# EAGLE design ADS1298-breakout (EAGLE 6.5.0)
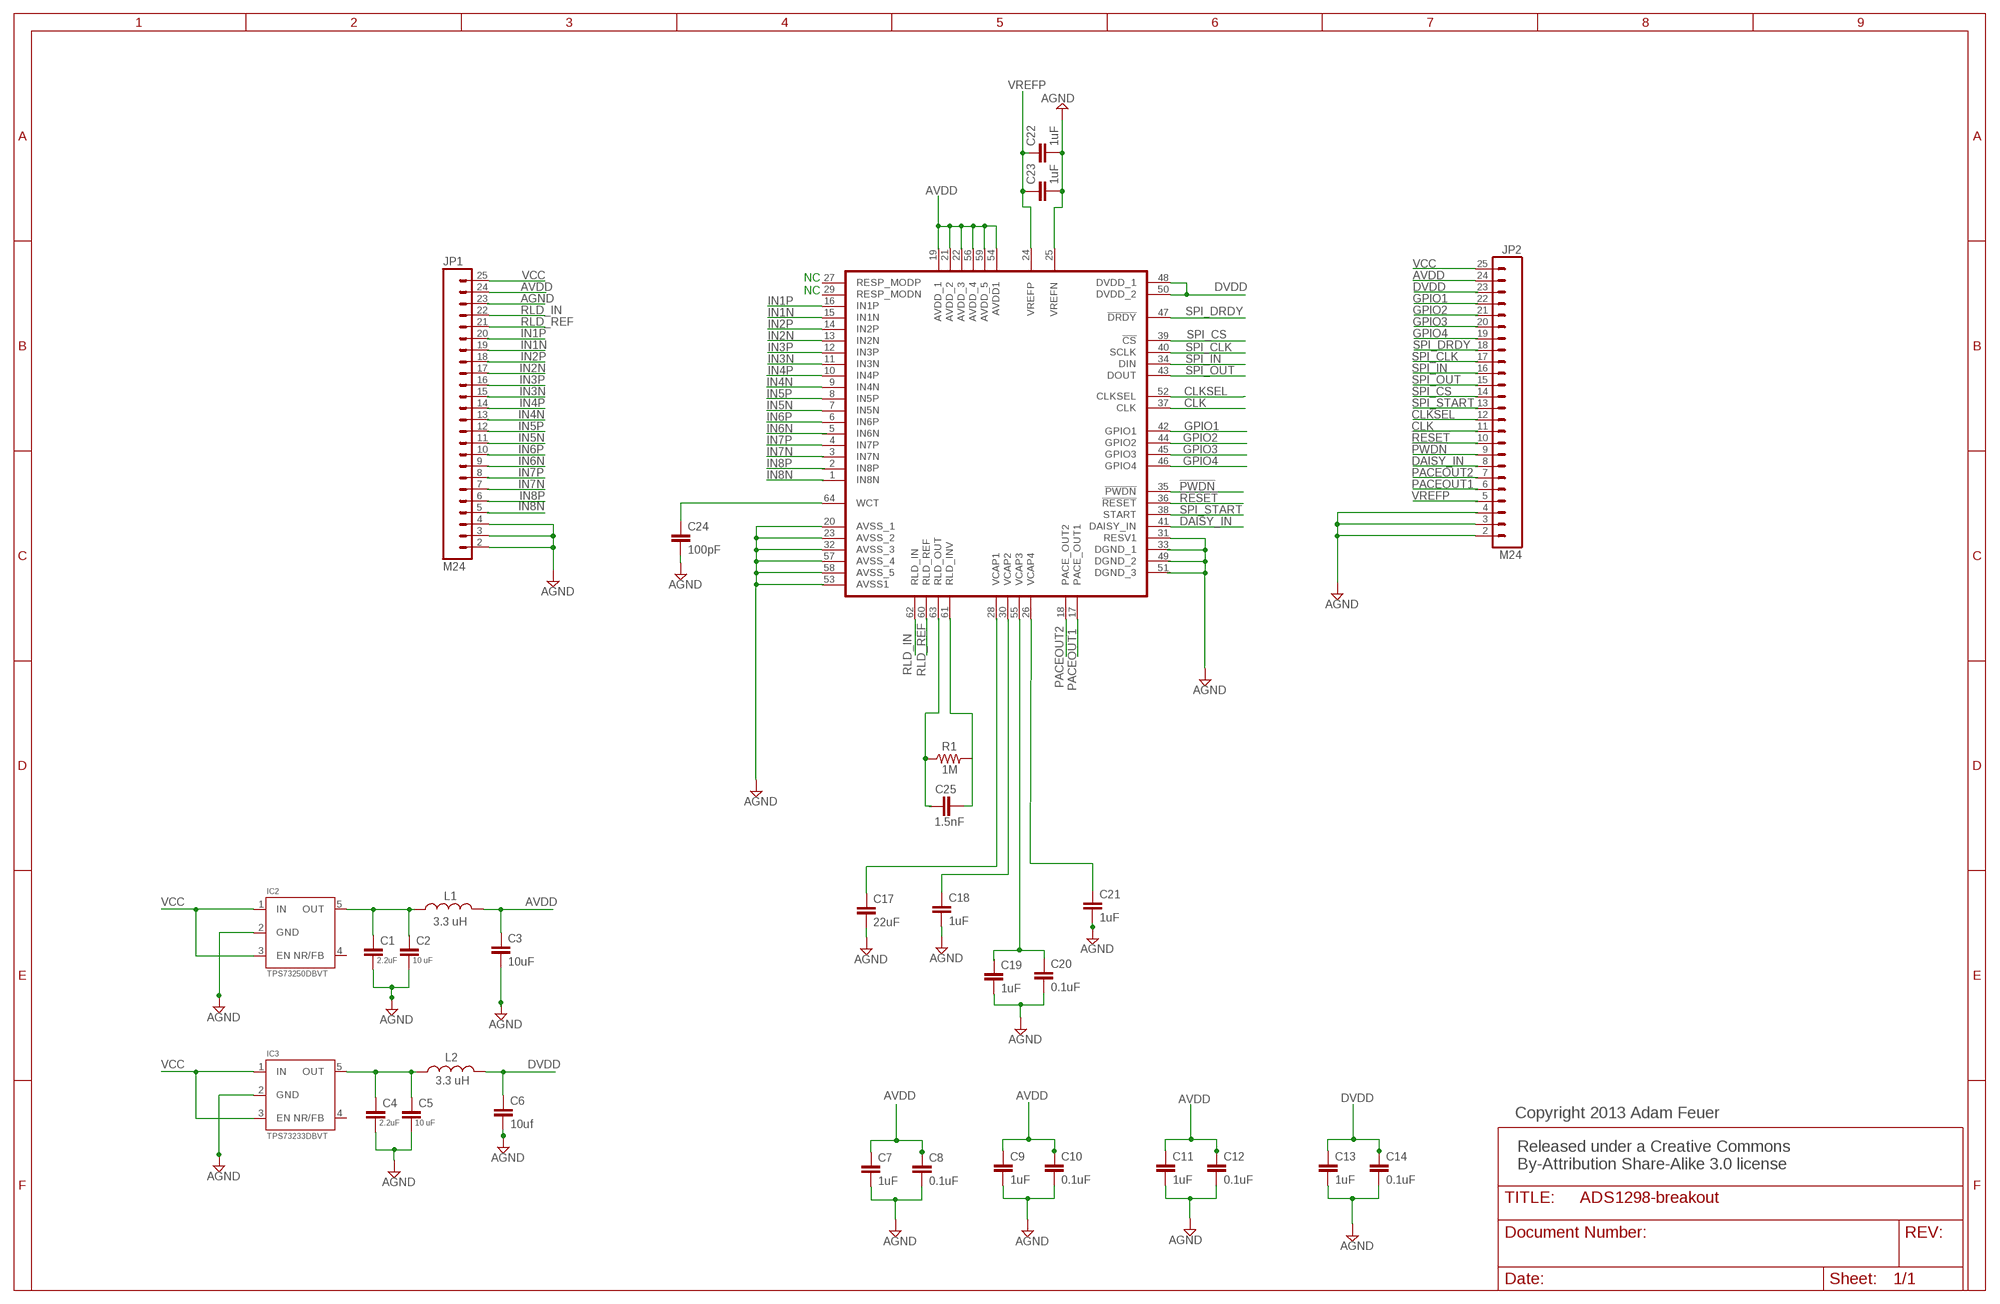
[diagram p0: schematic, sheet 1]

## Parts
C1  2.2uF  CAP0603-CAP  [0603-CAP]
C2  10 uF  CAP0603-CAP  [0603-CAP]
C3  10uF  CAP0603-CAP  [0603-CAP]
C4  2.2uF  CAP0603-CAP  [0603-CAP]
C5  10 uF  CAP0603-CAP  [0603-CAP]
C6  10uf  CAP0603-CAP  [0603-CAP]
C7  1uF  CAP0603-CAP  [0603-CAP]
C8  0.1uF  CAP0603-CAP  [0603-CAP]
C9  1uF  CAP0603-CAP  [0603-CAP]
C10  0.1uF  CAP0603-CAP  [0603-CAP]
C11  1uF  CAP0603-CAP  [0603-CAP]
C12  0.1uF  CAP0603-CAP  [0603-CAP]
C13  1uF  CAP0603-CAP  [0603-CAP]
C14  0.1uF  CAP0603-CAP  [0603-CAP]
C17  22uF  CAP0603-CAP  [0603-CAP]
C18  1uF  CAP0603-CAP  [0603-CAP]
C19  1uF  CAP0603-CAP  [0603-CAP]
C20  0.1uF  CAP0603-CAP  [0603-CAP]
C21  1uF  CAP0603-CAP  [0603-CAP]
C22  1uF  CAP0603-CAP  [0603-CAP]
C23  1uF  CAP0603-CAP  [0603-CAP]
C24  100pF  CAP0603-CAP  [0603-CAP]
C25  1.5nF  CAP0603-CAP  [0603-CAP]
IC1  ADS1298*PAG*  [TQFP64]
IC2  TPS73250DBVT  TPS732XXDBV  [SOT23-5]
IC3  TPS73233DBVT  TPS732XXDBV  [SOT23-5]
JP1  M24  [1X24]
JP2  M24  [1X24]
L1  3.3 uH  INDUCTOR0603  [0603]
L2  3.3 uH  INDUCTOR0603  [0603]
R1  1M  RESISTOR0603-RES  [0603-RES]

## Nets
!PWDN: IC1.35(!PWDN) JP2.9
!RESET: IC1.36(!RESET) JP2.10
AGND: C1.2 C2.2 C3.2 C4.2 C5.2 C6.2 C7.2 C8.2 C9.2 C10.2 C11.2 C12.2 C13.2 C14.2 C17.2 C18.2 C19.2 C20.2 C21.2 C22.2 C23.2 C24.2 IC1.20(AVSS_1) IC1.23(AVSS_2) IC1.25(VREFN) IC1.31(RESV1) IC1.32(AVSS_3) IC1.33(DGND_1) IC1.49(DGND_2) IC1.51(DGND_3) IC1.53(AVSS1) IC1.57(AVSS_4) IC1.58(AVSS_5) IC2.2(GND) IC3.2(GND) JP1.2 JP1.3 JP1.4 JP1.23 JP2.2 JP2.3 JP2.4
AVDD: C3.1 C7.1 C8.1 C9.1 C10.1 C11.1 C12.1 IC1.19(AVDD_1) IC1.21(AVDD_2) IC1.22(AVDD_3) IC1.54(AVDD1) IC1.56(AVDD_4) IC1.59(AVDD_5) JP1.24 JP2.24 L1.2
CLK: IC1.37(CLK) JP2.11
CLKSEL: IC1.52(CLKSEL) JP2.12
DAISY_IN: IC1.41(DAISY_IN) JP2.8
DVDD: C6.1 C13.1 C14.1 IC1.48(DVDD_1) IC1.50(DVDD_2) JP2.23 L2.2
GPIO1: IC1.42(GPIO1) JP2.22
GPIO2: IC1.44(GPIO2) JP2.21
GPIO3: IC1.45(GPIO3) JP2.20
GPIO4: IC1.46(GPIO4) JP2.19
IN1N: IC1.15(IN1N) JP1.19
IN1P: IC1.16(IN1P) JP1.20
IN2N: IC1.13(IN2N) JP1.17
IN2P: IC1.14(IN2P) JP1.18
IN3N: IC1.11(IN3N) JP1.15
IN3P: IC1.12(IN3P) JP1.16
IN4N: IC1.9(IN4N) JP1.13
IN4P: IC1.10(IN4P) JP1.14
IN5N: IC1.7(IN5N) JP1.11
IN5P: IC1.8(IN5P) JP1.12
IN6N: IC1.5(IN6N) JP1.9
IN6P: IC1.6(IN6P) JP1.10
IN7N: IC1.3(IN7N) JP1.7
IN7P: IC1.4(IN7P) JP1.8
IN8N: IC1.1(IN8N) JP1.5
IN8P: IC1.2(IN8P) JP1.6
N$1: C4.1 C5.1 IC3.5(OUT) L2.1
N$2: C1.1 C2.1 IC2.5(OUT) L1.1
N$3: C17.1 IC1.28(VCAP1)
N$4: C18.1 IC1.30(VCAP2)
N$5: C19.1 C20.1 IC1.55(VCAP3)
N$7: C24.1 IC1.64(WCT)
N$8: C21.1 IC1.26(VCAP4)
PACEOUT1: IC1.17(PACE_OUT1) JP2.6
PACEOUT2: IC1.18(PACE_OUT2) JP2.7
RLD_IN: IC1.62(RLD_IN) JP1.22
RLD_INV: C25.2 IC1.61(RLD_INV) R1.2
RLD_OUT: C25.1 IC1.63(RLD_OUT) R1.1
RLD_REF: IC1.60(RLD_REF) JP1.21
SPI_CLK: IC1.40(SCLK) JP2.17
SPI_CS: IC1.39(!CS) JP2.14
SPI_DRDY: IC1.47(!DRDY) JP2.18
SPI_IN: IC1.34(DIN) JP2.16
SPI_OUT: IC1.43(DOUT) JP2.15
SPI_START: IC1.38(START) JP2.13
VCC: IC2.1(IN) IC2.3(EN) IC3.1(IN) IC3.3(EN) JP1.25 JP2.25
VREFP: C22.1 C23.1 IC1.24(VREFP) JP2.5
Unconnected: IC1.27(RESP_MODP) IC1.29(RESP_MODN) IC2.4(NR/FB) IC3.4(NR/FB)

## Notes on the sheet
- NC
- NC
- Copyright 2013 Adam Feuer
- Released under a Creative Commons 
  By-Attribution Share-Alike 3.0 license

## Library data of the parts
C1-C14 C17-C25 = SparkFun-Passives:CAP: Capacitor Standard 0603 ceramic capacitor, and 0.1" leaded capacitor.
IC1 = burr-brown-5a:ADS1298: 8-Channel, 24-Bit Analog-To-Digital Converter With Integrated ECG Front End. Warning: PAG variant (TQFP package) does not have Respiration Module - pins 27 and 29 must stay unconnected! Drawn 23.07.2011 by Tomasz Boleslaw CEDRO (http://www.tomek.cedro.info).
IC2 IC3 = TPS32xx:TPS732XX: Cap-Free, NMOS, 250mA Low Dropout Regulator with Reverse Current Protection
JP1 JP2 = SparkFun-Connectors:M24: 1x24 .1" header
L1 L2 = SparkFun-Passives:INDUCTOR: Inductors Basic Inductor/Choke - 0603 and 1206. Footprints are not proven and vary greatly between part numbers. SRN6045- 33uH, 20% 1.4A
R1 = SparkFun-Passives:RESISTOR: Resistor Basic schematic elements and footprints for 0603, 1206, and PTH resistors.

## Board
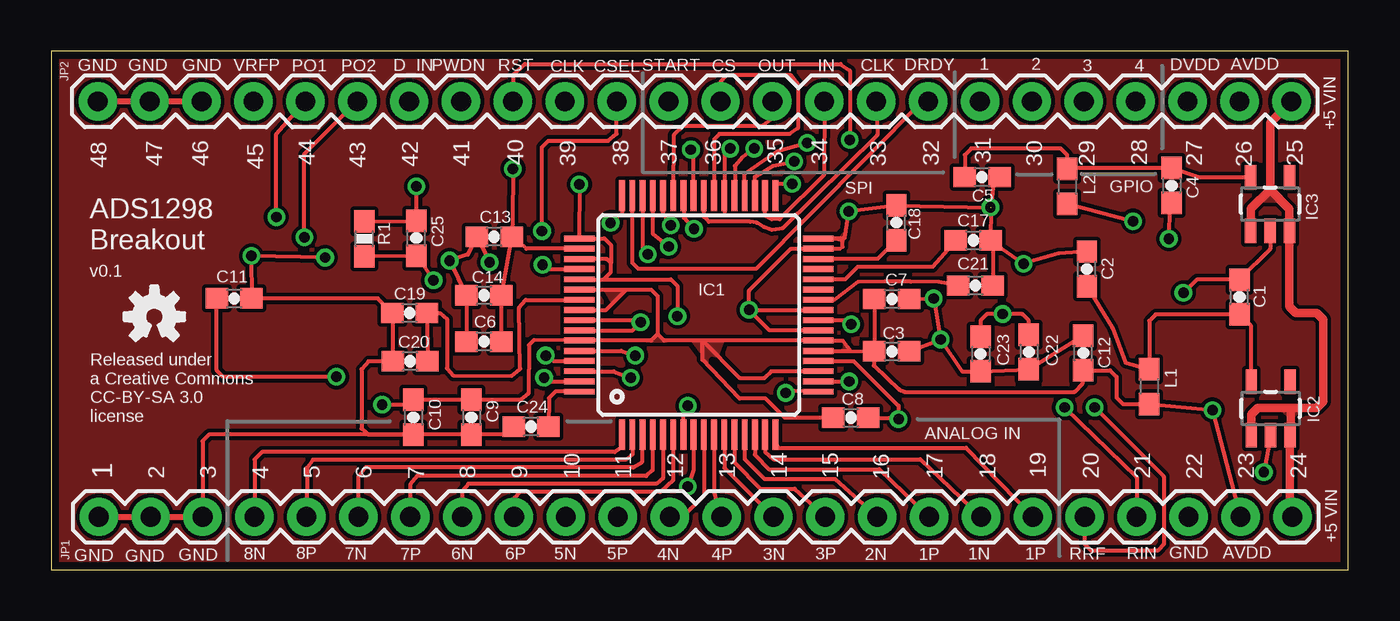
[diagram p1: board, top side]
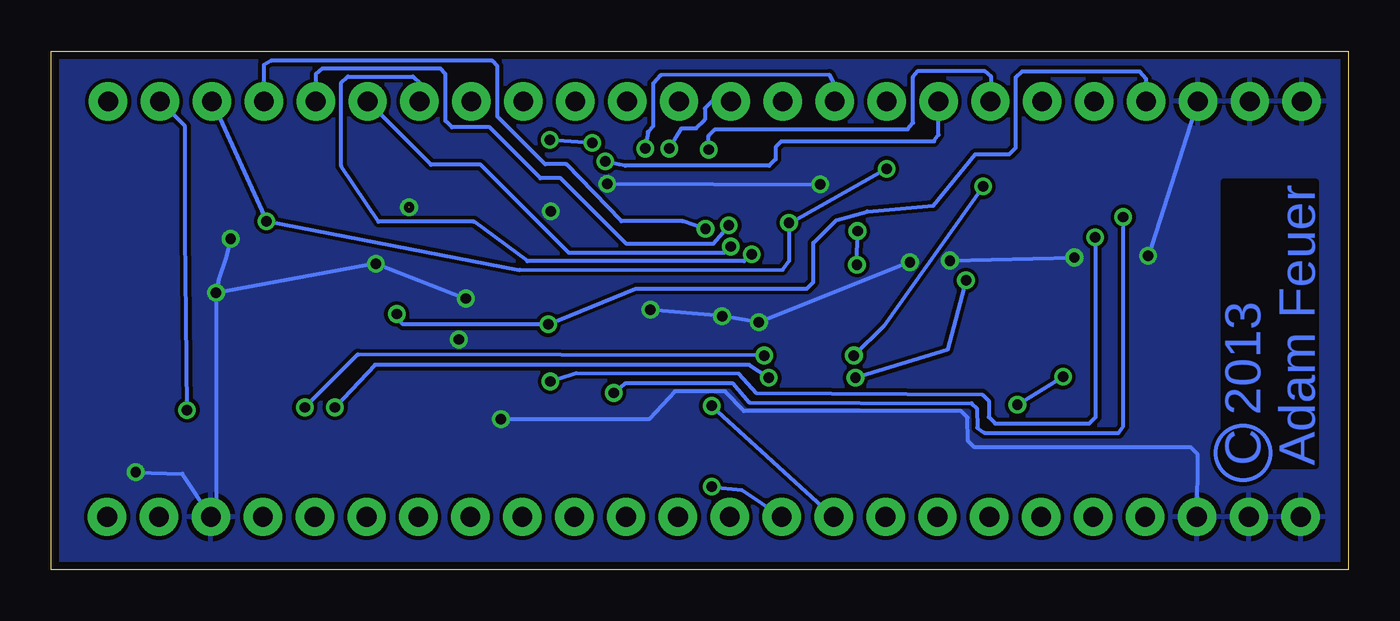
[diagram p2: board, bottom side, seen from below]

Size 63.5 x 25.4 mm. Coordinates in mm from the lower left corner, seen from the top.
Outline: 0,0 63.5,0 63.5,25.4 0,25.4 0,0
Copper layers (1*16): Top 0.0356mm / dielectric 1.5011mm / Bottom 0.0356mm
Design rules "APCircuits": minimum track width 8mil, minimum drill 13mil, track to track 7mil, track to pad 7mil, pad to pad 7mil, via to via 7mil, smd to smd 7mil, copper to edge 15mil, drill to drill 7mil, minimum pad ring 7mil, minimum via ring 7mil, stop-mask expansion 4mil, vias tented up to drill 0mil, thermal gap 10mil

### Footprints (pad centres in the part's own frame; a part is rotated, then mirrored left to right if it is on the bottom)
0603-CAP = smd 1.1 x 1: 1 -0.85,0; 2 0.85,0
TQFP64 = smd 1.5 x 0.285: 1 -5.85,3.75; 2 -5.85,3.25; 3 -5.85,2.75; 4 -5.85,2.25; 5 -5.85,1.75; 6 -5.85,1.25; 7 -5.85,0.75; 8 -5.85,0.25; 9 -5.85,-0.25; 10 -5.85,-0.75; 11 -5.85,-1.25; 12 -5.85,-1.75; 13 -5.85,-2.25; 14 -5.85,-2.75; 15 -5.85,-3.25; 16 -5.85,-3.75; 33 5.85,-3.75; 34 5.85,-3.25; 35 5.85,-2.75; 36 5.85,-2.25; 37 5.85,-1.75; 38 5.85,-1.25; 39 5.85,-0.75; 40 5.85,-0.25; 41 5.85,0.25; 42 5.85,0.75; 43 5.85,1.25; 44 5.85,1.75; 45 5.85,2.25; 46 5.85,2.75; 47 5.85,3.25; 48 5.85,3.75 | smd 0.285 x 1.5: 17 -3.75,-5.85; 18 -3.25,-5.85; 19 -2.75,-5.85; 20 -2.25,-5.85; 21 -1.75,-5.85; 22 -1.25,-5.85; 23 -0.75,-5.85; 24 -0.25,-5.85; 25 0.25,-5.85; 26 0.75,-5.85; 27 1.25,-5.85; 28 1.75,-5.85; 29 2.25,-5.85; 30 2.75,-5.85; 31 3.25,-5.85; 32 3.75,-5.85; 49 3.75,5.85; 50 3.25,5.85; 51 2.75,5.85; 52 2.25,5.85; 53 1.75,5.85; 54 1.25,5.85; 55 0.75,5.85; 56 0.25,5.85; 57 -0.25,5.85; 58 -0.75,5.85; 59 -1.25,5.85; 60 -1.75,5.85; 61 -2.25,5.85; 62 -2.75,5.85; 63 -3.25,5.85; 64 -3.75,5.85
SOT23-5 = smd 0.55 x 1.2: 1 -0.95,-1.3; 2 0,-1.3; 3 0.95,-1.3; 4 0.95,1.3; 5 -0.95,1.3
1X24 = drill 0.965 pad 1.88: 2 -26.67,0; 3 -24.13,0; 4 -21.59,0; 5 -19.05,0; 6 -16.51,0; 7 -13.97,0; 8 -11.43,0; 9 -8.89,0; 10 -6.35,0; 11 -3.81,0; 12 -1.27,0; 13 1.27,0; 14 3.81,0; 15 6.35,0; 16 8.89,0; 17 11.43,0; 18 13.97,0; 19 16.51,0; 20 19.05,0; 21 21.59,0; 22 24.13,0; 23 26.67,0; 24 29.21,0; 25 31.75,0
0603 = smd 1.1 x 1: 1 -0.85,0; 2 0.85,0
0603-RES = smd 1.1 x 1: 1 -0.85,0; 2 0.85,0

### Placement (x,y rotation side)
C1  58.17,13.36 90 top
C2  50.7,14.73 90 top
C3  41.15,10.69 0 top
C4  54.84,18.82 270 top
C5  45.57,19.23 0 top
C6  21.18,11.18 180 top
C7  41.15,13.26 0 top
C8  39.14,7.44 0 top
C9  20.57,7.47 270 top
C10  17.73,7.47 270 top
C11  8.97,13.28 0 top
C12  50.52,10.62 90 top
C13  21.69,16.31 180 top
C14  21.18,13.44 180 top
C17  45.14,16.13 0 top
C18  41.38,16.99 90 top
C19  17.55,12.57 180 top
C20  17.58,10.21 180 top
C21  45.24,13.92 0 top
C22  47.85,10.67 270 top
C23  45.49,10.57 270 top
C24  23.5,7.01 180 top
C25  17.88,16.23 90 top
IC1  31.7,12.47 90 top
IC2  59.69,7.9 0 top
IC3  59.66,17.91 0 top
JP1  29.01,2.59 0 top
JP2  28.96,22.94 0 top
L1  53.75,8.97 270 top
L2  49.73,18.77 270 top
R1  15.34,16.21 90 top
U$1  [OSHW-LOGO-S]  5.05,12.4 0 top

### Tracks (layer width: path | path; a pad name or v marks a point on that pad's centre or on a via)
!PWDN  (via drill 0.51)
  Top 0.203: IC1.35 34.45,19.23 35.36,19.79 v36.37,19.99
  Bottom 0.203: JP2.9 20.07,21.3 20.28,20.98 27.75,20.98 28.04,20.69 28.04,20.1 28.36,19.79 35.4,19.79 35.69,19.85 v36.37,19.99
!RESET  (via drill 0.51)
  Top 0.203: JP2.10 22.63,24.24 23.18,24.76 38.65,24.76 39.09,24.45 v39.09,21.06 | IC1.36 33.95,19.39 35.53,20.5 v37.01,20.9
  Bottom 0.203: v39.09,21.06 v37.01,20.9
AGND  (via drill 0.51)  (1 unrouted)
  Top 0.203: IC3.2 59.66,15.71 C1.2 56.07,14.21 v55.42,13.56 | IC2.2 v59.36,4.78 | C4.2 54.85,17.93 54.74,17.82 v54.71,16.2 | C5.2 46.11,18.92 46.01,17.73 | 46.01,17.73 C17.2 | C2.2 49.31,15.49 v47.6,14.99 C17.2 | C3.2 v43.54,11.28 | 46.01,17.73 C18.2 v39.04,17.55 38.84,16.26 | C7.2 v43.2,13.28 v43.54,11.28 | IC1.32 38.05,16.23 | 38.05,16.23 38.84,16.26 | IC1.33 35.46,18.9 v36.27,18.9 | C24.2 22.43,6.62 C9.2 C10.2 | C10.2 15.53,6.62 15.19,6.91 15.19,9.82 15.53,10.21 C20.2 16.73,12.55 C19.2 15.99,13.28 C11.2 v9.8,15.37 v13.41,15.29 | v34.16,12.72 IC1.25 | v34.16,12.72 34.16,13.67 36.22,15.72 IC1.31 38.61,15.72 38.73,15.82 38.73,16.13 | IC1.23 35.17,11.72 v34.16,12.72 | IC1.58 28.46,11.72 v28.85,12.12 28.75,12.22 IC1.57 | 27.41,15.01 27.41,14.58 27.05,14.22 IC1.53 30.34,14.22 30.66,13.9 v30.66,12.42 | 27.41,15.01 27.2,15.21 IC1.51 | 27.41,15.01 27.41,15.9 27.09,16.22 IC1.49 v25.86,18.87 | C6.2 C14.2 v19.51,15.14 20.4,15.43 C13.2 v21.46,15.06 | C12.2 C22.2 C23.2 44.59,9.72 v43.54,11.28 | C17.2 46.09,16.13 C21.2 | C8.2 41.4,7.44 v41.48,7.37 41.48,8.03 39.28,10.22 IC1.20 | C10.2 7.73,6.62 7.42,6.3 JP1.4 | 38.84,16.26 38.73,16.13 | 38.73,16.13 38.35,16.21 38.05,16.23
  Top 0.305: JP2.2 JP2.3 JP2.4 | JP1.2 JP1.3 JP1.4
  Bottom 0.203: v59.36,4.78 57.07,4.7 JP1.23 55.42,1.88 v55.42,13.56 | v55.42,13.56 v47.6,14.99 v43.2,13.28 | v54.71,16.2 54.95,15.24 55.3,14.24 v55.42,13.56 | JP2.4 v9.8,15.37 | v34.16,12.72 v30.66,12.42 v28.85,12.12 v21.46,15.06 | v19.51,15.14 v13.41,15.29 | JP1.4 7.4,5.68 7.72,5.99 18.3,5.99 18.62,6.31 18.64,7.46 18.96,7.77 29.59,7.77 30.5,8.74 32.97,8.74 34.24,7.37 v41.48,7.37 | v36.27,18.9 v25.86,18.87
  other vias: 45.97,17.75
  pour Bottom (rank 6): 0,25.4 0,-0.03 63.5,0 63.5,25.4
  pour Top: 38.79,16.54 38.53,16.26 38.84,16.03
AVDD  (via drill 0.51)
  Top 0.203: IC1.54 28.17,13.72 | 28.17,13.72 29.38,13.72 29.69,13.4 29.69,11.54 | 29.69,11.54 29.38,11.22 IC1.59 23.64,11.25 23.39,11.01 23.37,8.63 22.97,8.32 C9.1 C10.1 17.66,8.08 v16.2,8.08 | 31.88,11.22 IC1.22 38.73,11.23 38.96,10.93 39.14,10.71 | 31.88,11.22 30.01,11.22 29.69,11.54 | IC1.21 38.42,10.71 39.14,10.71 | 39.14,10.71 C3.1 | C3.1 40.27,10 41.51,8.84 41.76,8.71 50.1,8.71 50.49,9.13 C12.1 51.83,9.77 52.15,9.45 52.15,8.43 52.46,8.12 L1.2 v56.84,7.82 JP1.24 | v13.97,9.45 8.43,9.45 8.12,9.77 C11.1 | IC1.19 35.25,9.72 34.9,9.37 33.73,9.37 31.88,11.22 | C8.1 35.92,7.44 34.98,8.38 33.71,8.38 31.88,10.29 31.88,11.22 | C7.1 C3.1 | IC1.56 27.17,12.72 28.17,13.72
  Bottom 0.203: v56.84,7.82 56.9,12.37 56.95,16.38 56.95,21.72 JP2.24 | v16.2,8.08 v13.97,9.45
  pour Top: 27.43,13 28.19,13.74 27.03,13.74
  pour Top: 29.13,11.13 30.15,11.13 29.69,11.51
  pour Top: 31.29,11.23 32.18,10.06 32.18,10.31 32.31,10.44 32.64,10.36 32.97,11.23
  pour Top: 38.94,10.69 38.99,11.05 38.76,11.1 38.76,10.87 38.63,10.79
CLK  (via drill 0.51)
  Top 0.203: v34.42,20.62 33.82,20.19 33.48,19.77 IC1.37
  Bottom 0.203: JP2.11 25.15,23.79 25.41,24.23 33.67,24.21 34.04,23.81 34.04,21.74 34.29,21.44 v34.42,20.62
CLKSEL  (via drill 0.51)
  Top 0.203: v24.03,16.59 24.03,20.69 24.35,21.01 27.27,21.01 27.69,21.35 JP2.12 | v24.05,14.94 24.27,14.72 IC1.52
  Bottom 0.203: v24.05,14.94 v24.03,16.59
DAISY_IN  (via drill 0.51)
  Top 0.203: IC1.41 31.45,20.44 v31.32,20.57
  Bottom 0.203: v31.32,20.57 31.32,21.25 31,21.56 21.58,21.56 21.31,21.88 21.31,24.14 21.07,24.43 17.82,24.43 17.5,24.17 JP2.8
DVDD  (via drill 0.51)
  Top 0.203: IC1.50 23.27,15.72 C13.1 | C13.1 C14.1 C6.1 | L2.2 v52.96,17.07 | IC1.48 27.95,17.43 v27.38,16.99 | v22.61,19.63 22.59,17.06 C13.1
  Bottom 0.203: JP2.23 v52.96,17.07 40.56,14.68 27.69,14.7 27.38,15.14 v27.38,16.99 27.33,16.97 v22.61,19.63
GPIO1  (via drill 0.51)
  Top 0.203: IC1.42 30.98,17.23 v31.47,16.69
  Bottom 0.203: v31.47,16.69 32.59,17.07 35.59,17.07 38.28,19.86 39.32,19.86 41.66,22.2 41.66,24.65 41.9,24.92 52.74,24.92 53.09,24.73 JP2.22
GPIO2  (via drill 0.51)
  Top 0.203: IC1.44 29.95,17.5 v30.33,16.87
  Bottom 0.203: v30.33,16.87 30.63,16.48 31.09,15.95 35.33,15.95 38.56,19.18 39.55,19.18 42.04,21.67 43.88,21.67 44.2,21.98 44.2,24.27 44.44,24.54 50.23,24.54 50.55,24.27 JP2.21
GPIO3  (via drill 0.51)
  Top 0.203: IC1.45 29.45,16.47 v30.23,15.82
  Bottom 0.203: v30.23,15.82 30.56,15.52 38.15,15.52 42.47,19.84 44.91,19.84 JP2.20
GPIO4  (via drill 0.51)
  Top 0.203: IC1.46 28.95,15.68 v29.21,15.44
  Bottom 0.203: v29.21,15.44 29.57,15.11 40.18,15.11 42.8,17.04 47.47,17.04 49.3,19.76 49.3,23.86 48.98,24.15 45.78,24.15 45.47,23.86 JP2.19
IN1N
  Top 0.203: IC1.15 34.95,5.77 35.36,5.41 42.55,5.41 JP1.19
IN1P
  Top 0.203: IC1.16 35.42,6.31 35.59,5.97 44.78,5.97 JP1.20
IN2N
  Top 0.203: IC1.13 33.95,5.42 34.92,4.45 38.38,4.45 JP1.17
IN2P
  Top 0.203: IC1.14 34.45,5.63 35.13,4.93 40.54,4.93 JP1.18
IN3N
  Top 0.203: IC1.11 32.95,5 JP1.15
IN3P
  Top 0.203: IC1.12 33.45,5.26 34.72,3.96 36.4,3.96 JP1.16
IN4N
  Top 0.203: IC1.9 31.95,3.63 30.91,2.59 JP1.13
IN4P
  Top 0.203: IC1.10 32.45,3.77 JP1.14
IN5N  (via drill 0.51)
  Top 0.203: IC1.7 30.95,7.68 v31.17,8.03
  Bottom 0.203: v31.17,8.03 JP1.11
IN5P  (via drill 0.51)
  Top 0.203: IC1.8 31.45,4.88 v31.17,4.06
  Bottom 0.203: v31.17,4.06 29.69,3.91 JP1.12
IN6N
  Top 0.203: IC1.5 29.95,4.48 29.63,4.22 20.43,4.22 20.12,3.85 JP1.9
IN6P
  Top 0.203: IC1.6 30.45,4.38 29.83,3.81 22.95,3.81 22.66,3.49 JP1.10
IN7N
  Top 0.203: IC1.3 28.92,5.27 28.5,5 15.38,5 15.04,4.56 JP1.7
IN7P
  Top 0.203: IC1.4 29.45,4.89 29.13,4.6 17.92,4.6 17.58,4.18 JP1.8
IN8N
  Top 0.203: IC1.1 27.92,5.98 27.58,5.77 10.32,5.77 9.96,5.4 JP1.5
IN8P
  Top 0.203: IC1.2 28.45,5.63 28.13,5.38 12.81,5.38 12.52,4.99 JP1.6
N$1
  Top 0.203: IC3.5 56.19,19.21 C4.1 49.78,19.67 L2.1 49.73,20.31 49.42,20.62 45.03,20.62 44.72,20.31 C5.1
N$2
  Top 0.203: IC2.5 58.74,11.94 C1.1 54.06,12.51 53.75,12.19 L1.1 52.59,10.15 51.94,11.86 C2.1
N$3
  Top 0.203: C17.1 43.14,14.83 39.47,14.83 38.86,14.22 IC1.28
N$4
  Top 0.203: C18.1 40.45,15.22 IC1.30
N$5
  Top 0.203: C20.1 C19.1 19.04,12.57 19.38,12.28 19.38,9.87 19.67,9.53 22.54,9.5 22.96,9.84 22.91,12.85 23.23,13.22 IC1.55
N$6
  pour Top (rank 6): 0,25.4 0,0 63.5,0 63.5,25.4
N$7
  Top 0.203: IC1.64 24.69,8.72 24.37,8.4 C24.1
N$8
  Top 0.203: C21.1 43.45,14.1 42.06,14.11 40.83,14.12 39.5,14.1 38.34,13.22 IC1.26
PACEOUT1  (via drill 0.51)
  Top 0.203: IC1.17 36.38,8.75 v35.97,8.66 | v11.02,17.27 11.02,21.34 JP2.6
  Bottom 0.203: v35.97,8.66 35.84,8.74 35.38,9.14 30.15,9.14 29.34,8.2 18.45,8.15 18.19,7.91 18.16,6.95 17.82,6.71 11.24,6.71 11.02,7.02 v11.02,17.27
PACEOUT2  (via drill 0.51)
  Top 0.203: IC1.18 38.81,9.22 v39.06,9.22 | v12.39,16.28 12.39,20.34 JP2.7
  Bottom 0.203: v39.06,9.22 38.71,9.35 37.8,9.63 29.84,9.6 29.01,8.66 17.92,8.59 17.6,8.27 17.6,7.48 17.29,7.16 12.69,7.16 12.37,7.48 12.37,16.26 v12.39,16.28
RLD_IN  (via drill 0.51)
  Top 0.203: IC1.62 27.54,9.72 v28.37,9.4 | v49.61,7.95 53.14,4.52 JP1.22
  Bottom 0.203: v28.37,9.4 29.34,10.03 47.65,10.03 v49.61,7.95
RLD_INV  (via drill 0.51)
  Top 0.203: R1.2 C25.2 v17.88,18.77 | v24.21,10.49 24.6,10.22 IC1.61
  Bottom 0.203: v17.88,18.77 22.76,11.91 v24.21,10.49
RLD_OUT  (via drill 0.51)
  Top 0.203: R1.1 C25.1 v18.72,14.17 | v24.13,9.4 24.31,9.22 IC1.63
  Bottom 0.203: v18.72,14.17 19.63,10.77 v24.13,9.4
RLD_REF  (via drill 0.51)
  Top 0.203: IC1.60 27.91,10.72 v28.6,10.49 | v51.08,7.95 54.46,4.57 54.46,1.26 54.17,0.94 50.91,0.94 50.6,1.26 JP1.21
  Bottom 0.203: v28.6,10.49 48.46,10.54 48.49,10.54 v51.08,7.95
SPI_CLK
  Top 0.203: JP2.17 40.44,21.29 35.79,16.71 35.28,16.64 34.87,16.79 34.54,16.99 34.21,17.04 32.19,17.04 31.95,17.29 IC1.40
SPI_CS
  Top 0.203: JP2.14 32.77,23.89 33.08,24.23 36.18,24.23 36.55,23.79 36.55,21.61 36.14,21.34 32.72,21.34 32.45,21.07 IC1.39
SPI_DRDY
  Top 0.203: JP2.18 42.62,22.91 34.49,14.73 28.74,14.73 28.45,15.02 IC1.47
SPI_IN
  Top 0.203: JP2.16 37.82,19.33 35.66,17.17 35.27,17.17 34.95,17.34 IC1.34
SPI_OUT
  Top 0.203: JP2.15 35.31,22.1 34.8,21.72 30.92,21.72 30.48,21.27 IC1.43
SPI_START  (via drill 0.51)
  Top 0.203: IC1.38 32.98,17.53 32.98,20.35 v33.25,20.62
  Bottom 0.203: JP2.13 31.18,22.91 31.5,22.59 31.5,22.05 31.93,21.61 32.63,21.61 v33.25,20.62
VCC
  Top 0.406: 60.68,7.93 61.96,7.93 62.28,8.24 62.28,12.26 61.96,12.57 60.93,12.57 60.62,12.89 IC3.3 60.62,17.67 59.66,18.62 | 60.68,7.93 59.06,7.93 58.74,7.61 IC2.1 | 60.68,7.93 60.68,6.64 IC2.3 60.64,2.88 JP1.25 | JP2.25 59.66,21.89 59.66,18.62 | 59.66,18.62 58.73,17.68 58.73,16.62 IC3.1
  pour Top: 59.97,7.92 60.68,7.37 61.52,7.92
  pour Top: 59.03,17.98 60.25,17.98 59.66,18.57
VREFP  (via drill 0.51)
  Top 0.203: IC1.24 38.96,12.22 v39.17,12.01 | C23.1 45.49,12.21 45.81,12.52 v46.58,12.52 47.54,12.52 47.85,12.21 C22.1
  Bottom 0.203: JP2.5 9.91,24.04 10.22,24.41 15.96,24.41 16.28,24.12 16.28,20.66 16.6,20.34 18.26,20.34 20.32,17.83 23.55,17.55 25.07,17.12 26.19,16 26.19,14.08 26.5,13.77 34.87,13.77 v39.17,12.01 46.27,12.01 46.58,12.33 v46.58,12.52
(copper drawn outside any net)
  shapes: Bottom circle x1

### Text on the board
Bottom: C 2013 / Adam Feuer
tPlace: GND | GND | GND | VRFP | PO1 | PO2 | D_IN | PWDN | RST | CLK | CSEL | START | CS | OUT | IN | CLK | DRDY | 1 | 2 | 3 | 4 | DVDD | AVDD | +5 VIN | SPI | GPIO | ADS1298 / Breakout | v0.1 | Released under / a Creative Commons / CC-BY-SA 3.0 / license | ANALOG IN | +5 VIN | GND | GND | GND | 8N | 8P | 7N | 7P | 6N | 6P | 5N | 5P | 4N | 4P | 3N | 3P | 2N | 1P | 1N | 1P | RRF | RIN | GND | AVDD
tNames: 48 | 47 | 46 | 45 | 44 | 43 | 42 | 41 | 40 | 39 | 38 | 37 | 36 | 35 | 34 | 33 | 32 | 31 | 30 | 29 | 28 | 27 | 26 | 25 | 1 | 2 | 3 | 4 | 5 | 6 | 7 | 8 | 9 | 10 | 11 | 12 | 13 | 14 | 15 | 16 | 17 | 18 | 19 | 20 | 21 | 22 | 23 | 24